# Altium schematic sheet STM32.SchDoc
size 297 x 210 mm
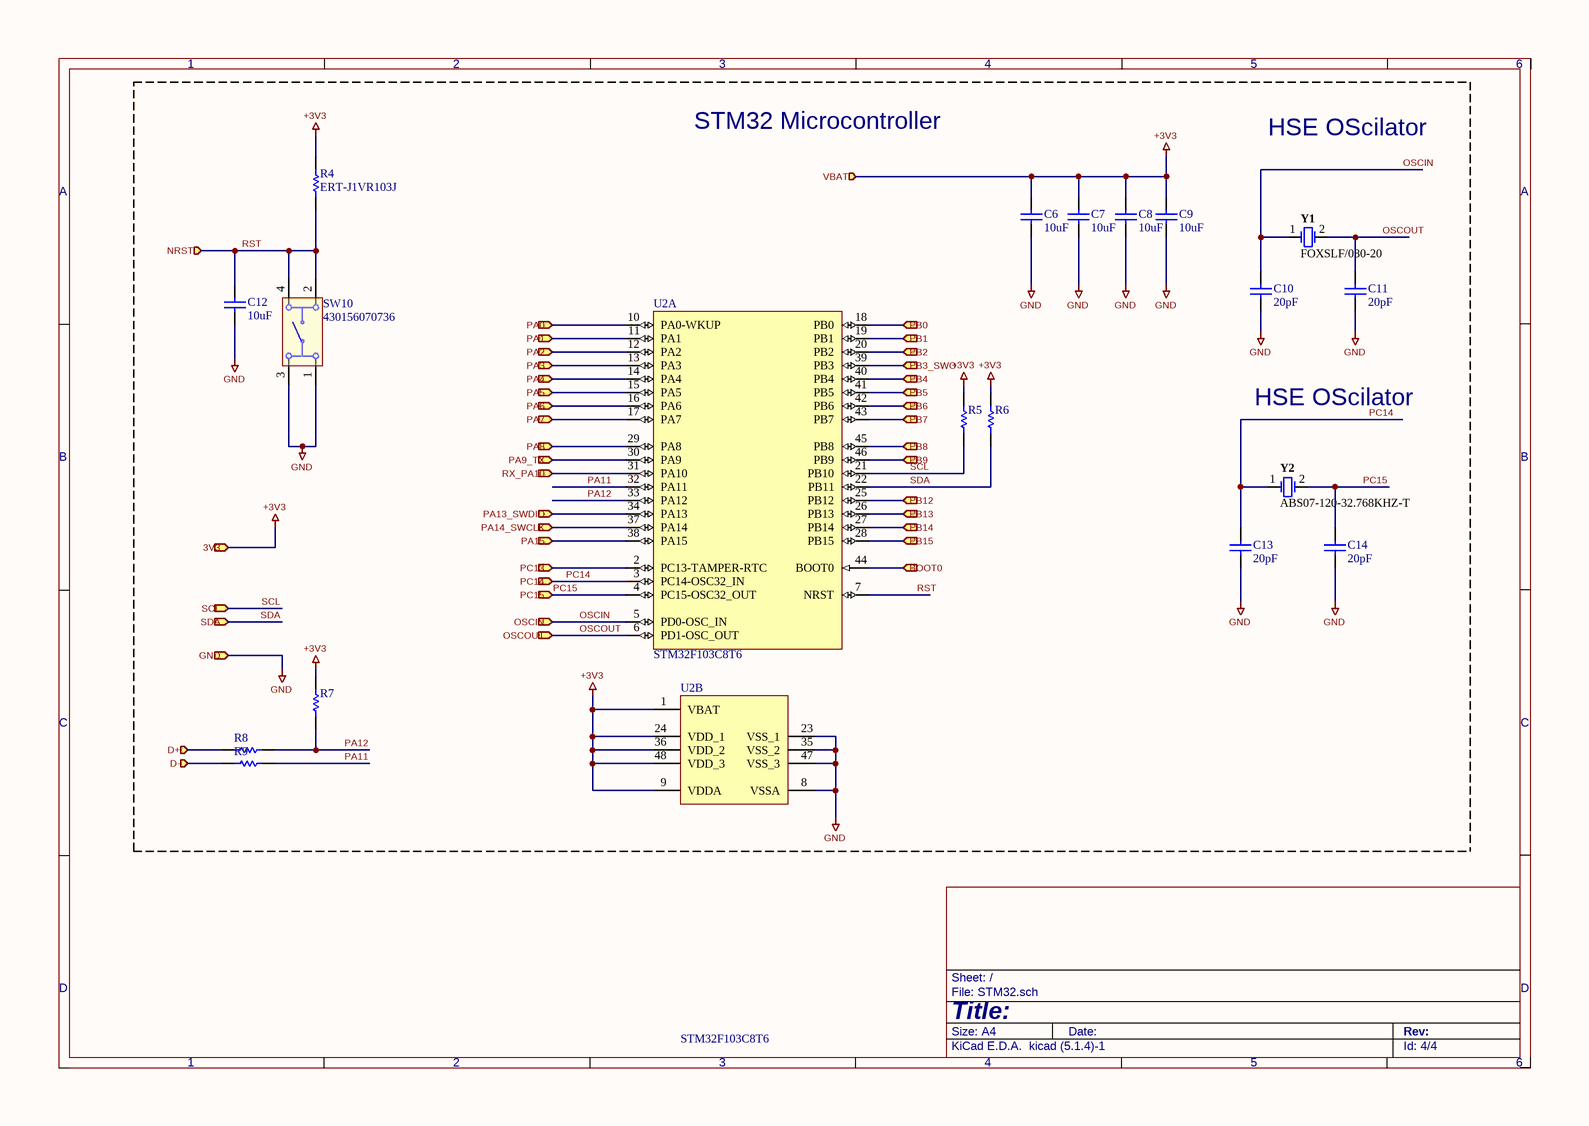
[diagram p0: STM32.SchDoc]

## Parts
C6  10uF  [CAPC1608X90X35NL10T15]
C7  10uF  [CAPC1608X90X35NL10T15]
C8  10uF  [CAPC1608X90X35NL10T15]
C9  10uF  [CAPC1608X90X35NL10T15]
C10  20pF  [CAPC1608X90X35NL10T15]
C11  20pF  [CAPC1608X90X35NL10T15]
C12  10uF  [CAPC1608X90X35NL10T15]
C13  20pF  [CAPC1608X90X35NL10T15]
C14  20pF  [CAPC1608X90X35NL10T15]
R4  ERT-J1VR103J  [RESC1608X90X30LL15T20]
R5  ERT-J1VR103J  [RESC1608X90X30LL15T20]  (value not drawn)
R6  ERT-J1VR103J  [RESC1608X90X30LL15T20]  (value not drawn)
R7  ERT-J1VR103J  [RESC1608X90X30LL15T20]  (value not drawn)
R8  ERT-J1VR103J  [RESC1608X90X30LL15T20]  (value not drawn)
R9  ERT-J1VR103J  [RESC1608X90X30LL15T20]  (value not drawn)
SW10  430156070736  [430156070736]
U2  STM32F103C8T6  [STM-LQFP48_L]  (parts A,B of 2)
Y1  FOXSLF/080-20  [FOX-FOXSLF080-20]
Y2  ABS07-120-32.768KHZ-T  [ABRA-ABS07_A_V]

## Ports
3V3 (in), BOOT0 (in), D+ (in), D- (in), GND (in), NRST (in), OSCIN (in), OSCOUT (in), PA0 (in), PA1 (in), PA2 (in), PA3 (in), PA4 (in), PA5 (in), PA6 (in), PA7 (in), PA8 (in), PA9_TX (in), PA13_SWDIO (in), PA14_SWCLK (in), PA15 (in), PB0 (in), PB1 (in), PB2 (in), PB3_SWO (in), PB4 (in), PB5 (in), PB6 (in), PB7 (in), PB8 (in), PB9 (in), PB12 (in), PB13 (in), PB14 (in), PB15 (in), PC13 (in), PC14 (in), PC15 (in), RX_PA10 (in), SCL (in), SDA (in), VBAT (in)

## Nets
+3V3: C6.2 C7.2 C8.2 C9.2 R4.2 R5.2 R6.2 R7.2 U2.1(VBAT) U2.9(VDDA) U2.24(VDD_1) U2.36(VDD_2) U2.48(VDD_3) ; port VBAT, port 3V3
GND: C6.1 C7.1 C8.1 C9.1 C10.1 C11.1 C12.1 C13.1 C14.1 SW10.1 SW10.3 U2.8(VSSA) U2.23(VSS_1) U2.35(VSS_2) U2.47(VSS_3) ; port GND
BOOT0: U2.44(BOOT0) ; port BOOT0
D+: R8.2 ; port D+
D-: R9.2 ; port D-
OSCIN: C10.2 U2.5(PD0-OSC_IN) Y1.1 ; port OSCIN
OSCOUT: C11.2 U2.6(PD1-OSC_OUT) Y1.2 ; port OSCOUT
PA0: U2.10(PA0-WKUP) ; port PA0
PA1: U2.11(PA1) ; port PA1
PA2: U2.12(PA2) ; port PA2
PA3: U2.13(PA3) ; port PA3
PA4: U2.14(PA4) ; port PA4
PA5: U2.15(PA5) ; port PA5
PA6: U2.16(PA6) ; port PA6
PA7: U2.17(PA7) ; port PA7
PA8: U2.29(PA8) ; port PA8
PA9_TX: U2.30(PA9) ; port PA9_TX
PA11: R9.1 U2.32(PA11)
PA12: R7.1 R8.1 U2.33(PA12)
PA13_SWDIO: U2.34(PA13) ; port PA13_SWDIO
PA14_SWCLK: U2.37(PA14) ; port PA14_SWCLK
PA15: U2.38(PA15) ; port PA15
PB0: U2.18(PB0) ; port PB0
PB1: U2.19(PB1) ; port PB1
PB2: U2.20(PB2) ; port PB2
PB3_SWO: U2.39(PB3) ; port PB3_SWO
PB4: U2.40(PB4) ; port PB4
PB5: U2.41(PB5) ; port PB5
PB6: U2.42(PB6) ; port PB6
PB7: U2.43(PB7) ; port PB7
PB8: U2.45(PB8) ; port PB8
PB9: U2.46(PB9) ; port PB9
PB12: U2.25(PB12) ; port PB12
PB13: U2.26(PB13) ; port PB13
PB14: U2.27(PB14) ; port PB14
PB15: U2.28(PB15) ; port PB15
PC13: U2.2(PC13-TAMPER-RTC) ; port PC13
PC14: C13.2 U2.3(PC14-OSC32_IN) Y2.1 ; port PC14
PC15: C14.2 U2.4(PC15-OSC32_OUT) Y2.2 ; port PC15
RST: C12.2 R4.1 SW10.2 SW10.4 U2.7(NRST) ; port NRST
RX_PA10: U2.31(PA10) ; port RX_PA10
SCL: R5.1 U2.21(PB10) ; port SCL
SDA: R6.1 U2.22(PB11) ; port SDA

## Notes on the sheet
- STM32 Microcontroller
- HSE OScilator
- 1
- 2
- 3
- 4
- 5
- 6
- A
- B
- C
- D
- Title:
- File: STM32.sch
- Sheet: /
- KiCad E.D.A.  kicad (5.1.4)-1
- Size: A4
- Date:
- Rev:
- Id: 4/4

## Library data of the parts
C6-C14 = CMP-2006-02792-1: Part Number: GRM188R60J106ME47D; Manufacturer: Murata
R4-R9 = CMP-2000-00869-1: Manufacturer: Panasonic; Part Number: ERT-J1VR103J
SW10 = CMP-1453-00006-1: WS-TATV THT Tact Switch 6X6 mm; Manufacturer: Wuerth Elektronik; NoPins: 04; ComponentLink2URL: http://katalog.we-online.de/em/datasheet/4301x6.pdf; ComponentLink1Description: Manufacturer URL; PackageReference: 430156070736; ComponentLink2Description: Datasheet; PartNumber: 430156070736; ComponentLink1URL: http://www.we-online.com
U2 = CMP-0237-00215-3: ARM Cortex-M3 32-bit MCU, 64 KB Flash, 20 KB Internal RAM, 37 I/Os, 48-pin LQFP, -40 to 85 degC, Tray; Supply Voltage(Vcc) min (V): 2; Internal RAM Size (kB): 20; FLASH Size (Prog) (kB): 64; A/D Converter: 2x12-bit (10 Channel); I/Os (High Current): 37; Operating Frequency(F) (Processor speed) (MHz): 72; Core: ARM Cortex-M3; ComponentLink3Description: Package Specification; Mounting Technology: Surface Mount; PartNumber: STM32F103C8T6; PackageReference: LQFP48; Packing: Tray; ComponentLink3URL: http://www.st.com/st-web-ui/static/active/en/resource/technical/document/datasheet/DM00058181.pdf; DatasheetVersion: Rev. 16; ComponentLink1URL: http://www.st.com/web/en/home.html; PackageVersion: Rev. 6, 06/2013; ComponentLink2URL: http://www.st.com/st-web-ui/static/active/en/resource/technical/document/datasheet/CD00161566.pdf; ComponentLink1Description: Manufacturer URL; ComponentLink2Description: Datasheet; PackageDescription: 48-Pin Low Profile Quad Flat Package, 7 x 7 mm Body, 0.5 mm Pitch
Y1 = CMP-1749-00002-1: Resistance Weld Thru-Hole Crystal, 8 MHz, -20 to 70 degC, 2-Pin THD, RoHS, Bulk; Dropout Voltage: 2 V; Outputs: 1; Nominal Output Voltage: 5 V; Min Input Voltage: 7 V; Case\Package: TO-263-3; Max Input Voltage: 35 V; Max Ouput Current: 1 A; Length: 10.24 mm; Max Operating Temperature: 125 degC; Mount: Surface Mount; PackageDescription: 2-Pin Through Hole Device, Body 11.35 x 4.65 mm; Package Quantity: 50; Pins: 3; ComponentLink2URL: http://download.siliconexpert.com/pdfs/2015/4/5/6/5/7/200/fox_/manual/35607121449963728hc49slf.pdf; PackageReference: FOXSLF080-20; Min Operating Temperature: 0 degC; Height: 30.02 mm; Packaging: Rail/Tube; Radiation Hardening: No; Width: 9.35 mm; ComponentLink1URL: http://www.foxonline.com/; DatasheetVersion: Mar-15; ComponentLink1Description: Manufacturer URL; Output Voltage: 5 V; RoHSCompliant: true; REACH SVHC: No SVHC; Output Current: 1 A; ComponentLink2Description: Datasheet
Y2 = CMP-2000-07587-1: Tuning Fork Crystal, 32.768 KHz, +/- 20 ppm, -40 to 85 degC, 2-Pin SMD, RoHS, Tape and Reel; Manufacturer: Abracon; Case\/Package: SMD/SMT; Series Resistance: 60KOhm; Frequency Tolerance: 20ppm; Load Capacitance: 6pF; ESR (Equivalent Series Resistance): 55KOhm; Max Operating Temperature: 85degC; Width: 0.061inch; Radiation Hardening: No; Lead Free: LeadFree; RoHSCompliant: True; Depth: 1.5mm; Datasheet URL: http://www.abracon.com/Resonators/ABS07-120-32.768kHz-T.pdf; Frequency: 32.768KHz; Termination: SMD/SMT; Manufacturer URL: http://www.abracon.com/; Package Quantity: 3000; Packaging: TapeandReel; Number of Pins: 2; Height: 0.035inch; Package Description: 2-Pin Surface Mount Device, Body 3.2 x 1.5 mm; Package Reference: ABS07; Mount: SurfaceMount; Tolerance: 20ppm; Mounting Technology: SurfaceMount; REACH SVHC: NoSVHC; Datasheet Version: 11/2014; Length: 3.2mm; Min Operating Temperature: -40degC